# EAGLE design master_jorge (EAGLE 7.1.0)
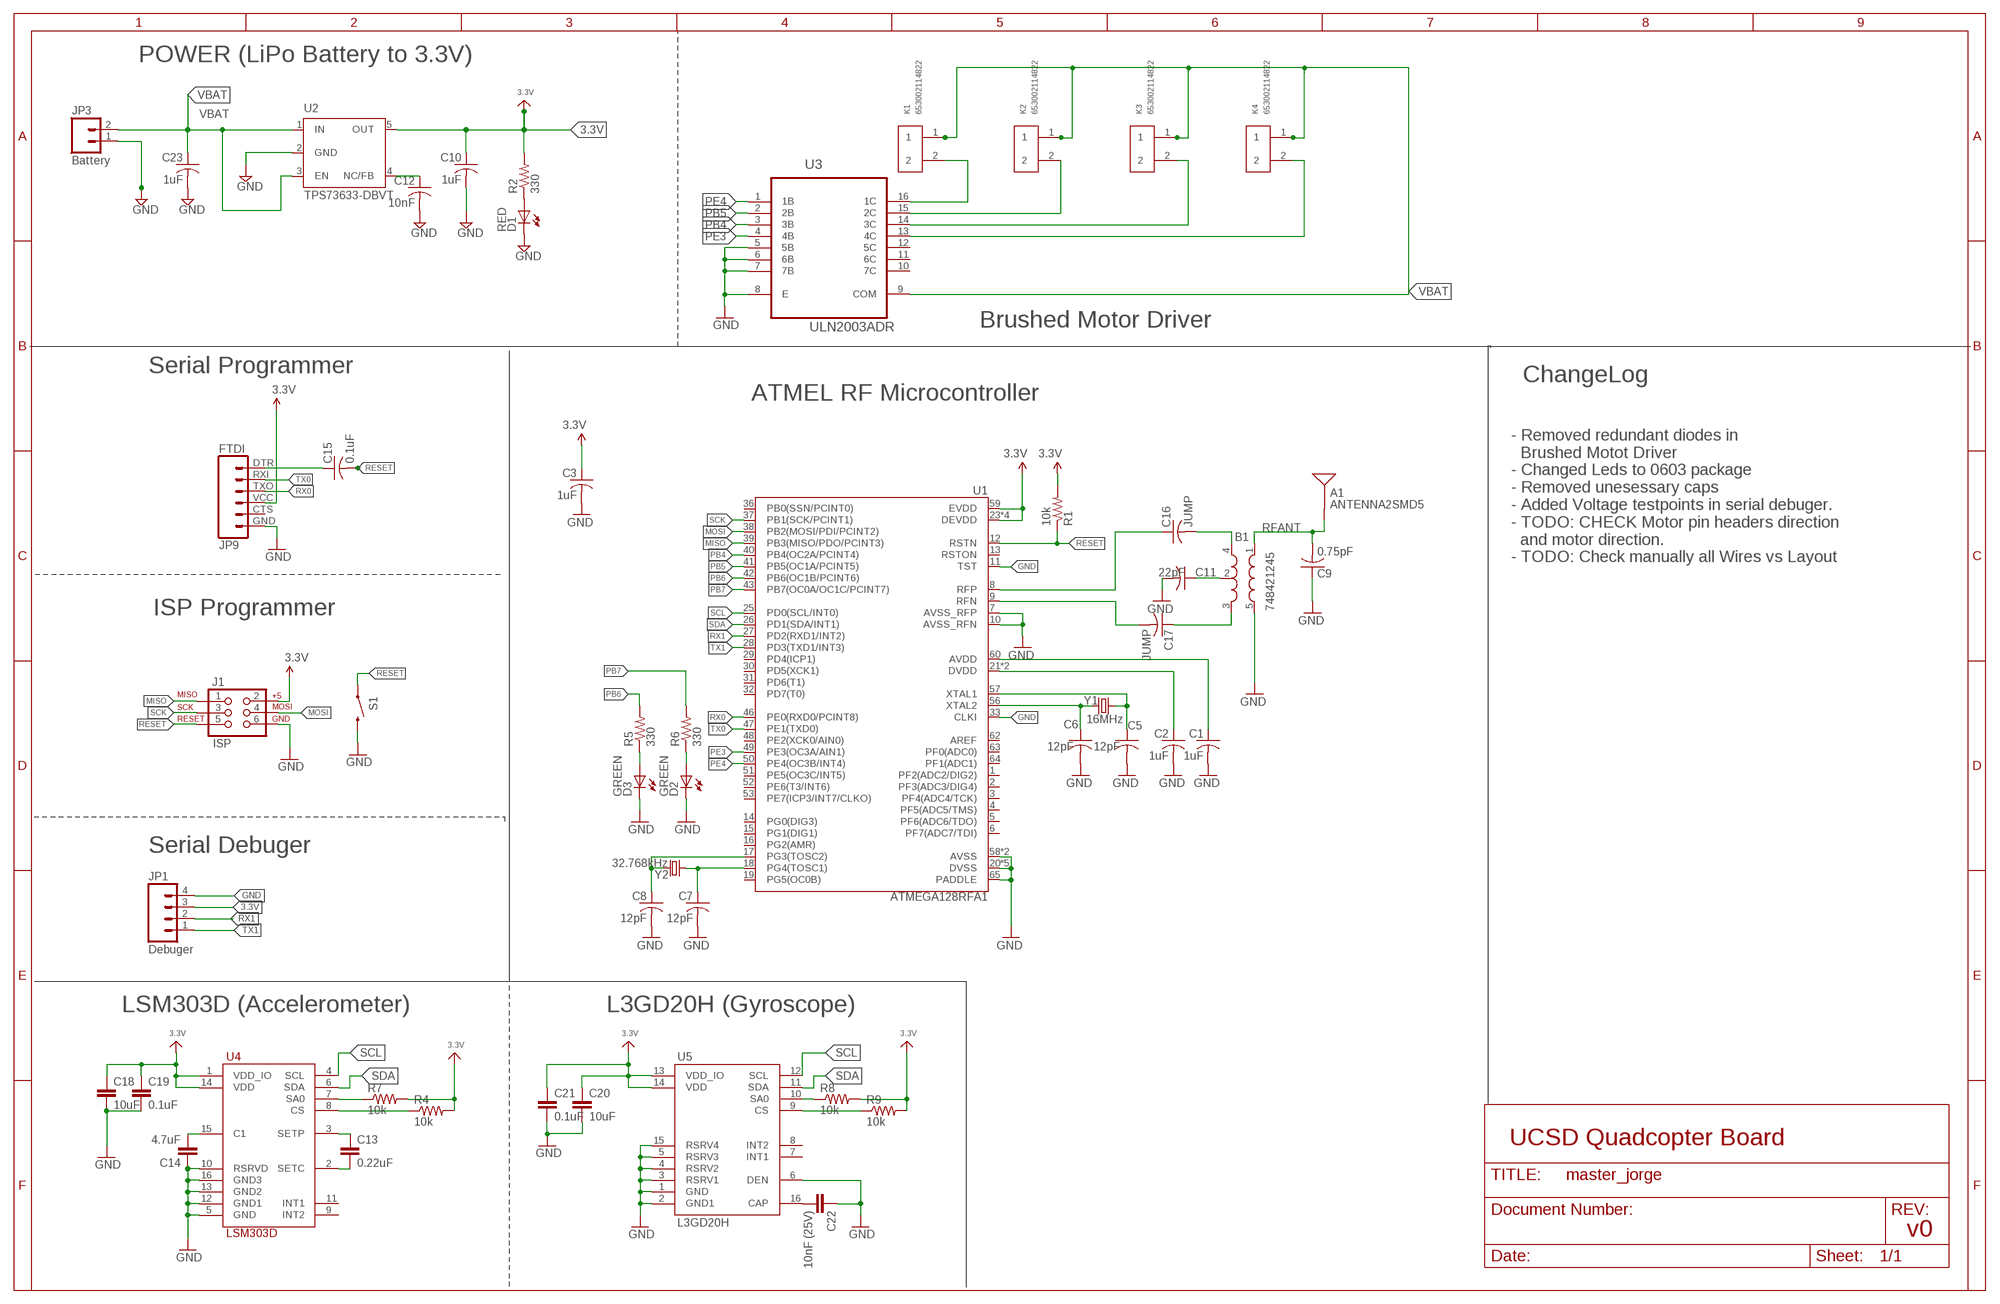
[diagram p0: schematic, sheet 1]

## Parts
A1  ANTENNA2SMD5  [ANTENNA-CHIP5]
B1  748421245  BALUN0805  [BALUN]
C1  1uF  C-USC0805  [C0805]
C2  1uF  C-USC0805  [C0805]
C3  1uF  C-USC0805  [C0805]
C5  12pF  C-USC0805  [C0805]
C6  12pF  C-USC0805  [C0805]
C7  12pF  C-USC0805  [C0805]
C8  12pF  C-USC0805  [C0805]
C9  0.75pF  C-USC0805  [C0805]
C10  1uF  C-USC0805  [C0805]
C11  22pF  C-USC0805  [C0805]
C12  10nF  C-USC0805  [C0805]
C13  0.22uF  CAP0805  [0805]
C14  4.7uF  CAP0805  [0805]
C15  0.1uF  C-USC0805  [C0805]
C16  JUMP  C-USC0805  [C0805]
C17  JUMP  C-USC0805  [C0805]
C18  10uF  CAP0805  [0805]
C19  0.1uF  CAP0805  [0805]
C20  10uF  CAP0805  [0805]
C21  0.1uF  CAP0805  [0805]
C22  10nF (25V)  CAP0805  [0805]
C23  1uF  C-USC0805  [C0805]
D1  RED  LEDCHIPLED_0603  [CHIPLED_0603]
D2  GREEN  LEDCHIPLED_0603  [CHIPLED_0603]
D3  GREEN  LEDCHIPLED_0603  [CHIPLED_0603]
J1  ISP  AVR_SPI_PRG_6NS  [2X3-NS]
JP1  Debuger  M04PTH  [1X04]
JP3  Battery  M02PTH  [1X02]
JP9  FTDI  FTDI_BASICPTH  [FTDI_BASIC]
K1  653002114822  [653002114822]
K2  653002114822  [653002114822]
K3  653002114822  [653002114822]
K4  653002114822  [653002114822]
R1  10k  R-US_R0805  [R0805]
R2  330  R-US_R0805  [R0805]
R4  10k  RESISTOR0805-RES  [0805]
R5  330  R-US_R0805  [R0805]
R6  330  R-US_R0805  [R0805]
R7  10k  RESISTOR0805-RES  [0805]
R8  10k  RESISTOR0805-RES  [0805]
R9  10k  RESISTOR0805-RES  [0805]
S1  SWITCH-MOMENTARY-2SMD  [TACTILE_SWITCH_SMD]
U1  ATMEGA128RFA1  [QFN-64]
U2  TPS73633-DBVT  [SOT23-DBV]
U3  ULN2003ADR  [SOIC127P600X175-16N]
U4  LSM303D  [LGA16_3X3MM]
U5  L3GD20H  [LGA16_3X3MM]
Y1  16MHz  CRYSTAL5X3  [CRYSTAL-SMD-5X3]
Y2  32.768kHz  CRYSTAL32-SMD  [CRYSTAL-32KHZ-SMD]

## Nets
3.3V: C3.1 C10.1 C18.1 C19.1 C20.1 C21.1 J1.2 JP1.3 JP9.VCC R1.2 R2.2 R4.2 R7.2 R8.2 R9.2 U1.23(DEVDD) U1.34(DEVDD) U1.44(DEVDD) U1.54(DEVDD) U1.59(EVDD) U2.5(OUT) U4.1(VDD_IO) U4.14(VDD) U5.13(VDD_IO) U5.14(VDD)
AVDD: C1.1 U1.60(AVDD)
DTR: C15.1 JP9.DTR
DVDD: C2.1 U1.21(DVDD) U1.22(DVDD)
GND: B1.5(GND) C1.2 C2.2 C3.2 C5.2 C6.2 C7.2 C8.2 C9.1 C10.2 C11.2 C12.2 C14.1 C18.2 C19.2 C20.2 C21.2 C22.1 C23.2 D1.C D2.C D3.C J1.6 JP1.4 JP3.1 JP9.GND S1.3 U1.7(AVSS_RFP) U1.10(AVSS_RFN) U1.11(TST) U1.20(DVSS) U1.24(DVSS) U1.33(CLKI) U1.35(DVSS) U1.45(DVSS) U1.55(DVSS) U1.58(AVSS) U1.61(AVSS) U1.65(PADDLE) U2.2(GND) U3.5(5B) U3.6(6B) U3.7(7B) U3.8(E) U4.5(GND) U4.10(RSRVD) U4.12(GND1) U4.13(GND2) U4.16(GND3) U5.1(GND) U5.2(GND1) U5.3(RSRV1) U5.4(RSRV2) U5.5(RSRV3) U5.6(DEN) U5.15(RSRV4)
MISO: J1.1 U1.39(PB3(MISO/PDO/PCINT3))
MOSI: J1.4 U1.38(PB2(MOSI/PDI/PCINT2))
N$1: C12.1 U2.4(NC/FB)
N$2: D1.A R2.1
N$3: C5.1 U1.57(XTAL1) Y1.3
N$4: C6.1 U1.56(XTAL2) Y1.1
N$5: C7.1 U1.18(PG4(TOSC1)) Y2.X1
N$6: C8.1 U1.17(PG3(TOSC2)) Y2.X2
N$7: B1.2(GND) C11.1
N$8: D3.A R5.1
N$9: C13.1 U4.3(SETP)
N$10: B1.4(OUT1) C16.2
N$11: B1.3(OUT2) C17.1
N$12: C13.2 U4.2(SETC)
N$13: D2.A R6.1
N$14: R4.1 U4.8(CS)
N$15: R7.1 U4.7(SA0)
N$16: C14.2 U4.15(C1)
N$17: R8.1 U5.10(SA0)
N$18: R9.1 U5.9(CS)
N$19: C22.2 U5.16(CAP)
N$29: K1.2 U3.16(1C)
N$30: K2.2 U3.15(2C)
N$31: K3.2 U3.14(3C)
N$32: K4.2 U3.13(4C)
PB4: U1.40(PB4(OC2A/PCINT4)) U3.3(3B)
PB5: U1.41(PB5(OC1A/PCINT5)) U3.2(2B)
PB6: R5.2 U1.42(PB6(OC1B/PCINT6))
PB7: R6.2 U1.43(PB7(OC0A/OC1C/PCINT7))
PE3: U1.49(PE3(OC3A/AIN1)) U3.4(4B)
PE4: U1.50(PE4(OC3B/INT4)) U3.1(1B)
RESET: C15.2 J1.5 R1.1 S1.1 U1.12(RSTN)
RFANT [RFSIG]: A1.FEED(SIGNAL) B1.1(IN) C9.2
RFN: C17.2 U1.9(RFN)
RFP: C16.1 U1.8(RFP)
RX0: JP9.TXO U1.46(PE0(RXD0/PCINT8))
RX1: JP1.2 U1.27(PD2(RXD1/INT2))
SCK: J1.3 U1.37(PB1(SCK/PCINT1))
SCL: U1.25(PD0(SCL/INT0)) U4.4(SCL) U5.12(SCL)
SDA: U1.26(PD1(SDA/INT1)) U4.6(SDA) U5.11(SDA)
TX0: JP9.RXI U1.47(PE1(TXD0))
TX1: JP1.1 U1.28(PD3(TXD1/INT3))
VBAT: C23.1 JP3.2 K1.1 K2.1 K3.1 K4.1 U2.1(IN) U2.3(EN) U3.9(COM)
Unconnected: JP9.CTS U1.1(PF2(ADC2/DIG2)) U1.2(PF3(ADC3/DIG4)) U1.3(PF4(ADC4/TCK)) U1.4(PF5(ADC5/TMS)) U1.5(PF6(ADC6/TDO)) U1.6(PF7(ADC7/TDI)) U1.13(RSTON) U1.14(PG0(DIG3)) U1.15(PG1(DIG1)) U1.16(PG2(AMR)) U1.19(PG5(OC0B)) U1.29(PD4(ICP1)) U1.30(PD5(XCK1)) U1.31(PD6(T1)) U1.32(PD7(T0)) U1.36(PB0(SSN/PCINT0)) U1.48(PE2(XCK0/AIN0)) U1.51(PE5(OC3C/INT5)) U1.52(PE6(T3/INT6)) U1.53(PE7(ICP3/INT7/CLKO)) U1.62(AREF) U1.63(PF0(ADC0)) U1.64(PF1(ADC1)) U3.10(7C) U3.11(6C) U3.12(5C) U4.9(INT2) U4.11(INT1) U5.7(INT1) U5.8(INT2)

## Notes on the sheet
- POWER (LiPo Battery to 3.3V)
- Brushed Motor Driver
- Serial Programmer
- ChangeLog
- ATMEL RF Microcontroller
- - Removed redundant diodes in 
    Brushed Motot Driver
  - Changed Leds to 0603 package
  - Removed unesessary caps
  - Added Voltage testpoints in serial debuger.
  - TODO: CHECK Motor pin headers direction
    and motor direction.
  - TODO: Check manually all Wires vs Layout
- ISP Programmer
- Serial Debuger
- LSM303D (Accelerometer) | L3GD20H (Gyroscope)
- UCSD Quadcopter Board
- v0

## Library data of the parts
A1 = SparkFun-RF:ANTENNA2: Chip antenna Single endded antenna. Common with smaller chip antennas. CHIP4 package is the GPS Chip Antenna SKU: GPS-08418. CHIP5 package is 2.4GHz chip antenna SKU: WRL-00144.
B1 = SparkFun-RF:BALUN: 0805 footprint balun- Ember 351/357
C1-C3 C5-C12 C15-C17 C23 = resistor:C-US: CAPACITOR, American symbol
C13 C14 C18-C22 = SparkFun-Capacitors:CAP: Capacitor Standard 0603 ceramic capacitor, and 0.1" leaded capacitor.
D1-D3 = led:LED: LED OSRAM: - CHIPLED LG R971, LG N971, LY N971, LG Q971, LY Q971, LO R971, LY R971 LH N974, LH R974 LS Q976, LO Q976, LY Q976 LO Q996 - Hyper CHIPLED LW Q18S LB Q993, LB Q99A, LB R99A - SideLED LS A670, LO A670, LY A670, LG A670, LP A670 LB A673, LV A673, LT A673, LW A673 LH A674 LY A675 LS A676, LA A676, LO A676, LY A676, LW A676 LS A679, LY A679, LG A679 - Hyper Micro SIDELED® LS Y876, LA Y876, LO Y876, LY Y876 LT Y87S - SmartLED LW L88C, LW L88S LB L89C, LB L89S, LG L890 LS L89K, LO L89K, LY L89K LS L896, LA L896, LO L896, LY L896 - TOPLED LS T670, LO T670, LY T670, LG T670, LP T670 LSG T670, LSP T670, LSY T670, LOP T670, LYG T670 LG T671, LOG T671, LSG T671 LB T673, LV T673, LT T673, LW T673 LH T674 LS T676, LA T676, LO T676, LY T676, LB T676, LH T676, LSB T676, LW T676 LB T67C, LV T67C, LT T67C, LS T67K, LO T67K, LY T67K, LW E67C LS E67B, LA E67B, LO E67B, LY E67B, LB E67C, LV E67C, LT E67C LW T67C LS T679, LY T679, LG T679 LS T770, LO T770, LY T770, LG T770, LP T770 LB T773, LV T773, LT T773, LW T773 LH T774 LS E675, LA E675, LY E675, LS T675 LS T776, LA T776, LO T776, LY T776, LB T776 LHGB T686 LT T68C, LB T68C - Hyper Mini TOPLED® LB M676 - Mini TOPLED Santana® LG M470 LS M47K, LO M47K, LY M47K Source: http://www.osram.convergy.de LUXEON: - LUMILED® LXK2-PW12-R00, LXK2-PW12-S00, LXK2-PW14-U00, LXK2-PW14-V00 LXK2-PM12-R00, LXK2-PM12-S00, LXK2-PM14-U00 LXK2-PE12-Q00, LXK2-PE12-R00, LXK2-PE12-S00, LXK2-PE14-T00, LXK2-PE14-U00 LXK2-PB12-K00, LXK2-PB12-L00, LXK2-PB12-M00, LXK2-PB14-N00, LXK2-PB14-P00, LXK2-PB14-Q00 LXK2-PR12-L00, LXK2-PR12-M00, LXK2-PR14-Q00, LXK2-PR14-R00 LXK2-PD12-Q00, LXK2-PD12-R00, LXK2-PD12-S00 LXK2-PH12-R00, LXK2-PH12-S00 LXK2-PL12-P00, LXK2-PL12-Q00, LXK2-PL12-R00 Source: www.luxeon.com KINGBRIGHT: KA-3528ASYC Source: www.kingbright.com
J1 = SparkFun-Connectors:AVR_SPI_PRG_6: AVR ISP 6 Pin This is the reduced ISP connector for AVR programming. Common on Arduino. This footprint will take up less PCB space and can be used with a 10-pin to 6-pin adapter such as SKU: BOB-08508
JP1 = SparkFun-Connectors:M04: Header 4 Standard 4-pin 0.1" header. Use with straight break away headers (SKU : PRT-00116), right angle break away headers (PRT-00553), swiss pins (PRT-00743), machine pins (PRT-00117), and female headers (PRT-00115). Molex polarized connector foot print use with SKU : PRT-08231 with associated crimp pins and housings. 1MM SMD Version SKU: PRT-10208
JP3 = SparkFun:M02: Header 2 Standard 2-pin 0.1" header. Use with straight break away headers (SKU : PRT-00116), right angle break away headers (PRT-00553), swiss pins (PRT-00743), machine pins (PRT-00117), and female headers (PRT-00115). Molex polarized connector foot print use with SKU : PRT-08233 with associated crimp pins and housings.
JP9 = SparkFun-Connectors:FTDI_BASIC: FTDI Basic header with labels
K1-K4 = Wuerth_Elektronik_eiCan_Wire_to_Board_Connectors:653002114822: WR-WTB 1.25mm Male Vertical Shrouded Header, 2 Pins=>Code : Con_WTB_1.25_PCB_THT_653002114822 <http://katalog.we-online.de/media/thumbs2/eican/thb_Con_WTB_1.25_PCB_THT_6530xx114822_pf2.jpg> Details see: http://katalog.we-online.de/en/em/653_0xx_114_822 Created 2014-06-06, Karrer Zheng 2014 (C) Würth Elektronik; OC_FARNELL: unknown
R1 R2 R5 R6 = resistor:R-US_: RESISTOR, American symbol
R4 R7-R9 = SparkFun-Passives:RESISTOR: Resistor Basic schematic elements and footprints for 0603, 1206, and PTH resistors.
S1 = SparkFun-Electromechanical:SWITCH-MOMENTARY-2: Various NO switches- pushbuttons, reed, etc
U1 = SparkFun-DigitalIC:ATMEGA128RFA1: ATmega128RFA1 8-bit AVR Microcontroller with Low Power 2.4GHz Transceiver for ZigBee and IEEE 802.15.4
U2 = Power:TPS73633-DBVT
U3 = Texas Instruments_By_element14_Batch_1:ULN2003ADR: 8-BIT SHIFT REGISTERS WITH 3-STATE OUTPUT REGISTERS; MPN: ULN2003ADR; OC_FARNELL: 1470513; OC_NEWARK: 77C3560; PACKAGE: SOIC-16; SUPPLIER: TEXAS INSTRUMENTS
U4 = IMU_parts:LSM303D
U5 = IMU_parts:L3GD20H
Y1 Y2 = SparkFun-FreqCtrl:CRYSTAL: Various standard crystals. Proven footprints. Spark Fun Electronics SKU : COM-00534

## Net classes
1 RFSIG: width 0.457 mm, clearance 0.205 mm to class 0, clearance 0.205 mm

## Board
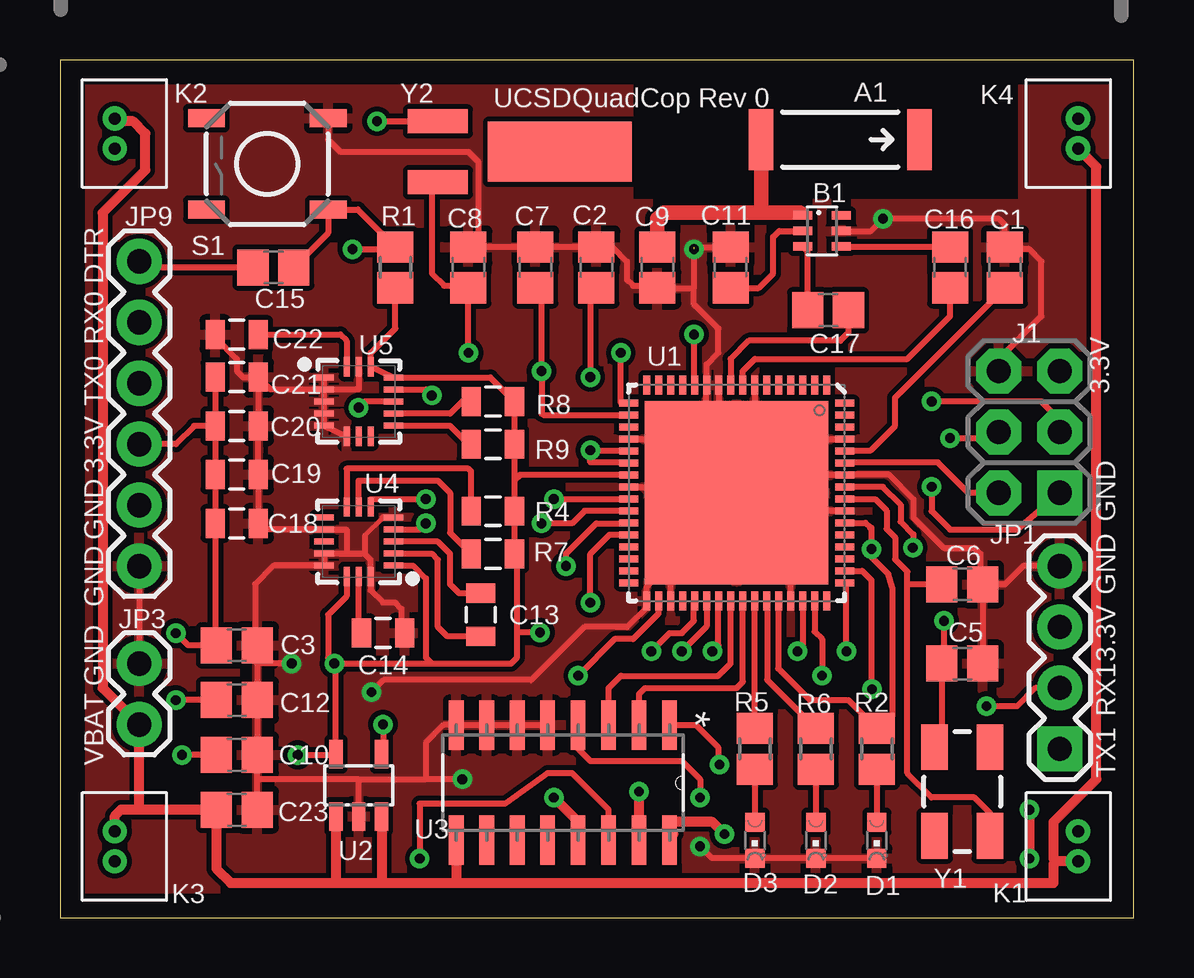
[diagram p1: board, top side]
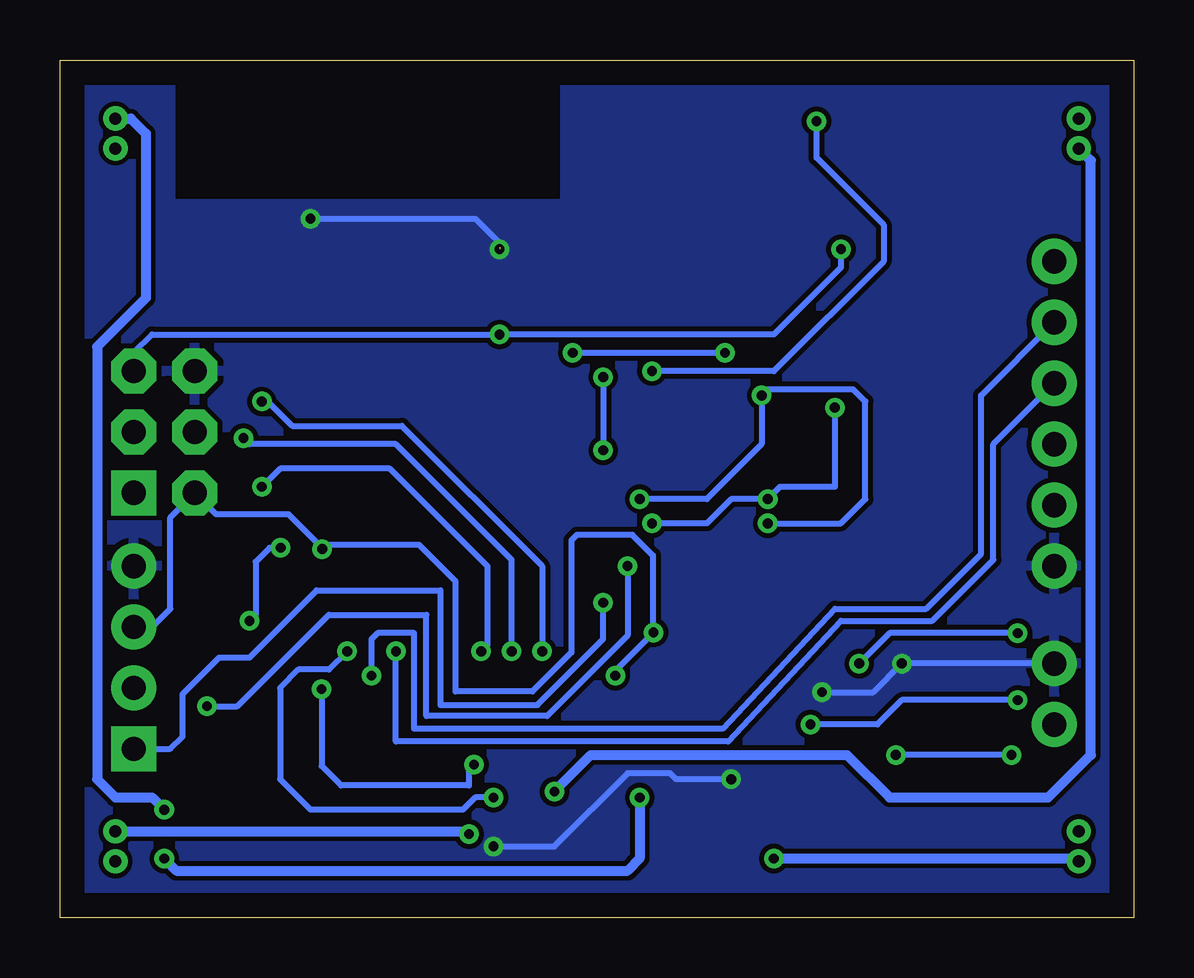
[diagram p2: board, bottom side, seen from below]

Size 44.73 x 35.75 mm. Coordinates in mm from the lower left corner, seen from the top.
Outline: 0,0 44.73,0 44.73,35.75 0,35.75 0,0
Copper layers (1*16): Top 0.035mm / dielectric 1.5mm / Bottom 0.035mm
Design rules "default *": minimum track width 1mil, minimum drill 0.003mm, track to track 8mil, track to pad 8mil, pad to pad 8mil, via to via 8mil, smd to smd 8mil, copper to edge 40mil, drill to drill 8mil, minimum pad ring 10mil, minimum via ring 8mil, stop-mask expansion 4mil, vias tented up to drill 0mil, thermal gap 10mil
tRestrict: area 35.1,34 to 36.6,35.3; area 35.1,30 to 36.6,31; area 28.5,34 to 30,35.3; area 23.9,30 to 28.5,35.3; area 30,30 to 35.1,35.3; area 36.6,30 to 39.9,35.3
bRestrict: area 30,30 to 35.1,35.3; area 36.6,30 to 39.9,35.3; area 23.9,30 to 28.5,35.3; area 28.5,34 to 30,35.3; area 35.1,34 to 36.6,35.3; area 35.1,30 to 36.6,31; area 28.5,30 to 30,34

### Footprints (pad centres in the part's own frame; a part is rotated, then mirrored left to right if it is on the bottom)
ANTENNA-CHIP5 = smd 1.016 x 2.54: FEED -3.302,0; NC 3.302,0
BALUN = smd 0.35 x 0.8: 1 -0.65,-0.8; 2 0,-0.8; 3 0.65,-0.8; 4 0.65,0.8; 5 0,0.8; 6 -0.65,0.8
C0805 = smd 1.3 x 1.5: 1 -0.85,0; 2 0.85,0
0805 = smd 0.8 x 1.2: 1 -0.9,0; 2 0.9,0
CHIPLED_0603 = smd 0.8 x 0.8: A 0,-0.75; C 0,0.75
2X3-NS = drill 1.016 pad 1.88 square: 1 -2.54,-1.27 | drill 1.016 pad 1.88 octagon: 2 -2.54,1.27; 3 0,-1.27; 4 0,1.27; 5 2.54,-1.27; 6 2.54,1.27
1X04 = drill 1.016 pad 1.88 square: 1 0,0 | drill 1.016 pad 1.88: 2 2.54,0; 3 5.08,0; 4 7.62,0
1X02 = drill 1.016 pad 1.88: 1 0,0; 2 2.54,0
FTDI_BASIC = drill 1.016 pad 1.88: CTS 10.16,0; DTR 0,0; GND 12.7,0; RXI 2.54,0; TXO 5.08,0; VCC 7.62,0
653002114822 = drill 0.5: 1 0.625,0; 2 -0.625,0
R0805 = smd 1.3 x 1.5: 1 -0.85,0; 2 0.85,0
TACTILE_SWITCH_SMD = smd 1.524 x 0.762: 1 -2.54,1.905; 2 2.54,1.905; 3 -2.54,-1.905; 4 2.54,-1.905
QFN-64 = smd 0.8 x 0.28: 1 -4.5,3.75; 2 -4.5,3.25; 3 -4.5,2.75; 4 -4.5,2.25; 5 -4.5,1.75; 6 -4.5,1.25; 7 -4.5,0.75; 8 -4.5,0.25; 9 -4.5,-0.25; 10 -4.5,-0.75; 11 -4.5,-1.25; 12 -4.5,-1.75; 13 -4.5,-2.25; 14 -4.5,-2.75; 15 -4.5,-3.25; 16 -4.5,-3.75; 33 4.5,-3.75; 34 4.5,-3.25; 35 4.5,-2.75; 36 4.5,-2.25; 37 4.5,-1.75; 38 4.5,-1.25; 39 4.5,-0.75; 40 4.5,-0.25; 41 4.5,0.25; 42 4.5,0.75; 43 4.5,1.25; 44 4.5,1.75; 45 4.5,2.25; 46 4.5,2.75; 47 4.5,3.25; 48 4.5,3.75 | smd 0.28 x 0.8: 17 -3.75,-4.5; 18 -3.25,-4.5; 19 -2.75,-4.5; 20 -2.25,-4.5; 21 -1.75,-4.5; 22 -1.25,-4.5; 23 -0.75,-4.5; 24 -0.25,-4.5; 25 0.25,-4.5; 26 0.75,-4.5; 27 1.25,-4.5; 28 1.75,-4.5; 29 2.25,-4.5; 30 2.75,-4.5; 31 3.25,-4.5; 32 3.75,-4.5; 49 3.75,4.5; 50 3.25,4.5; 51 2.75,4.5; 52 2.25,4.5; 53 1.75,4.5; 54 1.25,4.5; 55 0.75,4.5; 56 0.25,4.5; 57 -0.25,4.5; 58 -0.75,4.5; 59 -1.25,4.5; 60 -1.75,4.5; 61 -2.25,4.5; 62 -2.75,4.5; 63 -3.25,4.5; 64 -3.75,4.5 | smd 7.65 x 7.65: 65 0,0
SOT23-DBV = smd 0.55 x 1.2: 1 -0.95,-1.3; 2 0,-1.3; 3 0.95,-1.3; 4 0.95,1.3; 5 -0.95,1.3
SOIC127P600X175-16N = smd 2.057 x 0.61: 1 -4.801,8.89; 2 -4.801,7.62; 3 -4.801,6.35; 4 -4.801,5.08; 5 -4.801,3.81; 6 -4.801,2.54; 7 -4.801,1.27; 8 -4.801,0; 9 0,0; 10 0,1.27; 11 0,2.54; 12 0,3.81; 13 0,5.08; 14 0,6.35; 15 0,7.62; 16 0,8.89
LGA16_3X3MM = smd 0.8 x 0.25: 1 -1.45,1; 2 -1.45,0.5; 3 -1.45,0; 4 -1.45,-0.5; 5 -1.45,-1; 9 1.45,-1; 10 1.45,-0.5; 11 1.45,0; 12 1.45,0.5; 13 1.45,1 | smd 0.25 x 0.8: 6 -0.5,-1.45; 7 0,-1.45; 8 0.5,-1.45; 14 0.5,1.45; 15 0,1.45; 16 -0.5,1.45
CRYSTAL-SMD-5X3 = smd 1.9 x 1.1: 1 -1.85,-1.15; 2 1.85,-1.15; 3 1.85,1.15; 4 -1.85,1.15
CRYSTAL-32KHZ-SMD = smd 2.5 x 6: SHEILD 0,5.08 | smd 1 x 2.5: X1 -1.27,0; X2 1.27,0

### Placement (x,y rotation side)
A1  32.51,32.44 0 top
B1  31.75,28.63 270 top
C1  39.37,27.1 90 top
C2  22.35,27.1 90 top
C3  7.37,11.35 0 top
C5  37.59,10.59 0 top
C6  37.59,13.89 0 top
C7  19.81,27.1 90 top
C8  17.02,27.1 90 top
C9  24.89,27.1 90 top
C10  7.37,6.78 0 top
C11  27.94,27.1 90 top
C12  7.37,9.07 0 top
C13  17.53,12.62 270 top
C14  13.46,11.86 180 top
C15  8.89,27.1 0 top
C16  37.08,27.1 90 top
C17  32,25.32 0 top
C18  7.37,16.43 0 top
C19  7.37,18.47 0 top
C20  7.37,20.5 0 top
C21  7.37,22.53 0 top
C22  7.37,24.31 0 top
C23  7.37,4.5 0 top
D1  34.04,3.23 180 top
D2  31.5,3.23 180 top
D3  28.96,3.23 180 top
J1  40.39,20.24 90 top
JP1  41.66,7.04 90 top
JP3  3.3,10.59 270 top
JP9  3.3,27.36 270 top
K1  42.42,2.97 270 top
K2  2.29,32.69 90 top
K3  2.29,2.97 90 top
K4  42.42,32.69 270 top
R1  13.97,27.1 270 top
R2  34.04,7.04 90 top
R4  18.03,16.94 0 top
R5  28.96,7.04 90 top
R6  31.5,7.04 90 top
R7  18.03,15.16 0 top
R8  18.03,21.51 0 top
R9  18.03,19.74 0 top
S1  8.64,31.42 180 top
U1  28.19,17.7 270 top
U2  12.45,5.51 0 top
U3  16.51,3.23 270 top
U4  12.45,15.67 180 top
U5  12.45,21.51 0 top
Y1  37.59,5.26 90 top
Y2  15.75,31.93 270 top

### Tracks (layer width: path | path; a pad name or v marks a point on that pad's centre or on a via)
3.3V  (via drill 0.41)
  Top 0.254: 18.93,18.21 R9.2 R8.2 17.93,22.51 U5.13 U5.14 12.95,23.54 13.97,24.56 R1.2 | 18.93,18.21 R4.2 R7.2 19.05,15.05 19.05,11.9 | J1.2 37.85,17.7 36.58,18.97 32.71,18.97 U1.59 | 19.05,11.9 19.05,10.85 18.8,10.59 15.49,10.59 | U1.23 19.18,18.45 18.93,18.21 | C21.1 C20.1 | C20.1 C19.1 C18.1 6.47,11.4 C3.1 5.33,11.35 v4.83,11.86 | U4.14 11.95,13.39 11.18,12.62 11.18,10.85 v11.43,10.59 | v11.43,10.59 15.49,10.59 | U4.1 14.72,14.67 15.24,14.15 15.24,10.85 15.49,10.59 | C20.1 5.59,20.5 4.83,19.74 JP9.VCC | v11.43,10.59 11.5,10.53 U2.5 11.47,6.78 v9.91,6.78 | C10.1 v5.08,6.78 | U1.54 33.56,16.45 33.76,16.26 33.81,16.26 v33.81,15.37 33.81,15.04 34.52,14.33 34.67,13.77 34.67,8.39 R2.2 32.85,9.07 31.24,9.07 29.92,10.39 29.92,13.18 | U1.34 24.94,12.68 23.88,11.61 23.11,11.61 v21.59,10.08 | 29.92,13.2 U1.44 29.92,13.18 | 29.92,13.31 29.92,13.18 | v20,11.88 19.07,11.88 19.05,11.9
  Bottom 0.254: v4.83,11.86 10.16,11.86 v11.43,10.59 | v5.08,6.78 v9.91,6.78 | JP1.3 40.89,12.12 40.13,12.88 40.13,16.69 J1.2 38.23,16.82 35.2,16.82 33.81,15.42 v33.81,15.37 33.63,15.54 29.77,15.54 28.24,14.02 28.24,9.42 25.04,9.42 23.42,11.05 23.42,15.72 23.19,15.95 20.88,15.95 20.03,15.1 20.03,11.91 v20,11.88 21.59,10.29 v21.59,10.08
AVDD
  Top 0.254: U1.60 32.72,19.48 33.78,19.48 34.8,20.5 34.8,21.68 C1.1
DTR
  Top 0.254: C15.1 3.56,27.1 JP9.DTR
DVDD  (via drill 0.41)
  Top 0.254: C2.1 22.1,26.25 v22.1,22.53 | U1.22 23.69,18.97 22.1,18.97 v22.1,19.48 23.69,19.48 U1.21
  Bottom 0.254: v22.1,22.53 v22.1,19.48
GND  (via drill 0.41)  (1 unrouted)
  Top 0.178: 12.7,15.93 13.46,16.69
  Top 0.241: 13.46,16.69 13.88,16.69 U4.5
  Top 0.254: C23.2 8.22,5.77 | 8.22,5.77 C10.2 C12.2 8.22,10.59 | 8.22,10.59 C3.2 8.13,11.44 8.13,13.89 8.91,14.67 U4.13 U4.12 | 12.45,5.77 8.22,5.77 | C6.2 C5.2 | U3.5 U3.6 U3.7 U3.8 15.98,8.03 15.24,7.29 15.24,5.77 | 17.55,27.95 C7.2 C2.2 23.03,27.95 23.62,27.36 23.62,26.59 23.88,26.34 24.8,26.34 C9.1 26.42,26.25 | 17.55,27.95 C8.2 | 11.18,33.45 S1.3 11.18,32.44 11.68,31.93 17.02,31.93 17.42,31.52 17.42,28.08 17.55,27.95 | U5.2 10.99,22.02 8.77,22.02 C21.2 | 12.7,15.16 12.95,14.92 U4.16 12.95,13.65 13.46,13.13 13.97,13.13 14.22,12.88 14.22,12 C14.1 | 12.7,15.16 11.94,15.16 | 11.94,15.16 U4.12 | U4.12 | U4.5 13.45,16.67 | 12.7,15.93 12.7,15.16 | U5.1 U5.2 | U5.2 U5.3 U5.4 U5.5 U5.6 | 11.94,15.16 11.94,16.18 11.93,16.17 U4.10 8.53,16.17 C18.2 C19.2 C20.2 C21.2 | JP9.GND JP3.1 | U5.15 12.45,22.02 11,22.02 U5.2 | C22.1 6.47,24.19 7.37,23.29 7.37,22.78 7.62,22.53 C21.2 | v9.65,10.59 8.22,10.59 | JP1.4 40.13,14.66 39.37,13.89 C6.2 | U1.10 27.44,18.45 | 27.44,18.45 U1.65 | 27.44,18.45 26.94,17.95 25.6,17.95 | U1.7 28.94,19.95 | 28.94,19.95 27.44,18.45 | 28.94,19.95 U1.61 | U1.10 27.44,20.76 26.92,20.24 26.92,22.18 U1.11 26.94,23.06 27.43,23.55 27.43,24.56 26.42,25.58 26.42,26.25 | U1.10 27.44,20.23 27.94,19.74 25.65,19.74 25.4,19.99 25.36,19.95 U1.20 | U1.10 27.44,21.25 30.23,18.47 | 30.23,18.47 32.69,18.47 | U1.10 27.44,17.72 | 26.42,26.25 26.42,27.95 C11.2 | B1.5 33.78,28.63 v34.29,29.13 39.12,29.13 39.37,28.88 C1.2 39.46,27.86 40.39,27.86 40.89,27.36 40.89,25.07 39.12,23.29 J1.6 | 32.71,18.47 U1.58 32.69,18.47 | 34.04,2.46 D1.C D2.C D3.C 27.17,2.48 v26.67,2.97 | v16.76,5.77 15.24,5.77 | C6.2 38.35,13.98 38.35,15.16 38.1,15.42 36.83,15.42 35.56,16.69 35.56,17.45 34.54,18.47 32.69,18.47
  Top 0.254: U2.2 12.45,5.77 | 12.45,5.77 15.24,5.77 | U1.24 25.6,17.95 | 25.45,14.93 24.44,13.78 U1.33 24.44,12.94 23.62,12.12 21.84,12.12 20.32,10.59 19.63,9.9 13.48,9.9 v12.98,9.4 | 25.45,14.93 25.65,15.16 25.65,17.9 25.6,17.95 | U1.45 30.44,16.95 | 30.44,16.95 30.44,18.25 30.23,18.47 | U1.55 30.44,16.95 | U1.35 25.45,14.93
  Bottom 0.254: JP3.1 v9.65,10.59 10.85,9.4 v12.98,9.4 | v26.42,27.86 26.42,28.12 27.43,29.13 v34.29,29.13 | v16.76,5.77 19.05,5.77 19.3,6.02 21.08,6.02 24.13,2.97 v26.67,2.97
  pour Bottom: 0.28,35.56 0.28,0 44.48,0 44.48,35.81 0.28,35.81
  pour Top: 0.28,35.56 0.28,0 44.48,0 44.48,35.81 0.28,35.81
MISO  (via drill 0.41)
  Top 0.254: v27.18,11.1 27.43,11.35 27.43,13.19 U1.39 | J1.1 39.88,16.18 37.08,16.18 36.32,16.94 v36.32,17.96
  Bottom 0.254: v27.18,11.1 26.92,11.35 26.92,14.66 30.99,18.72 35.56,18.72 v36.32,17.96
MOSI  (via drill 0.41)
  Top 0.254: U1.38 26.94,12.14 v25.91,11.1 | v37.08,19.99 38.86,19.99 J1.4
  Bottom 0.254: v25.91,11.1 25.91,14.91 30.73,19.74 36.83,19.74 v37.08,19.99
N$1  (via drill 0.41)
  Top 0.254: C12.1 v4.83,9.07 | v13.46,8.05 13.46,6.88 U2.4
  Bottom 0.254: v4.83,9.07 9.65,9.07 10.67,8.05 v13.46,8.05
N$2
  Top 0.254: R2.1 D1.A
N$3  (via drill 0.41)
  Top 0.254: Y1.3 36.74,7.41 C5.1 36.83,10.68 v36.83,12.37 | U1.57 34.29,17.96 35.03,17.22 35.03,16.51 35.56,15.98 35.56,15.44 v35.53,15.42
  Bottom 0.254: v36.83,12.37 36.58,12.62 36.58,14.83 35.99,15.42 v35.53,15.42
N$4
  Top 0.254: Y1.1 38.74,4.36 38.1,5 36.32,5 35.31,6.02 35.31,13.89 | 35.31,13.89 35.31,14.43 34.8,14.94 34.8,15.85 34.44,16.2 34.44,16.97 33.96,17.45 U1.56 | C6.1 35.31,13.89
N$5  (via drill 0.41)
  Top 0.254: Y2.X1 16,33.2 | Y2.X1 14.99,33.2 | C7.1 20.07,26 v20.07,22.78 20.07,21.01 20.09,21.01 20.14,20.95 U1.18 | v13.21,33.2 Y2.X1
  Bottom 0.254: v20.07,22.78 14.99,22.78 10.41,27.36 10.41,28.88 13.21,31.67 v13.21,33.2
N$6  (via drill 0.41)
  Top 0.254: Y2.X2 15.49,30.66 15.49,26.85 16,26.34 16.93,26.34 C8.1 v17.02,23.55 | U1.17 23.37,21.45 v23.37,23.55
  Bottom 0.254: v23.37,23.55 v17.02,23.55
N$7
  Top 0.254: C11.1 29.12,26.25 29.72,26.85 29.72,28.37 29.97,28.63 B1.2
N$8
  Top 0.254: R5.1 D3.A
N$9
  Top 0.254: C13.1 16.63,13.52 16.26,13.89 16.26,15.16 15.75,15.67 U4.3
N$10
  Top 0.254: C16.2 32.57,27.95 B1.4
N$11
  Top 0.254: C17.1 31.15,27.77 B1.3
N$12
  Top 0.254: C13.2 16.14,11.72 15.75,12.12 15.75,14.91 15.49,15.17 U4.2
N$13
  Top 0.254: R6.1 D2.A
N$14
  Top 0.254: R4.1 17.13,18.6 17.02,18.72 11.94,18.72 U4.8
N$15
  Top 0.254: U4.7 12.45,18.21 15.75,18.21 16.26,17.7 16.26,16.04 R7.1
N$16
  Top 0.254: C14.2 12.56,12.25 12.45,12.37 U4.15
N$17
  Top 0.254: R8.1 16.76,21.51 16.26,21.01 U5.10
N$18
  Top 0.254: R9.1 17.02,19.74 16.26,20.5 13.91,20.5 U5.9
N$19
  Top 0.254: C22.2 11.68,24.31 11.94,24.05 11.94,22.97 U5.16
N$29  (via drill 0.41)
  Top 0.254: 25.65,3.48 U3.16
  Top 0.406: U3.16 25.4,3.99 27.18,3.99 v27.69,3.48
  Bottom 0.254: 27.55,3.6 v27.69,3.48
  Bottom 0.406: K1.2 27.55,3.6
N$30  (via drill 0.41)
  Top 0.406: U3.15 v24.13,5.26
  Bottom 0.406: v24.13,5.26 22.61,6.78 11.94,6.78 10.16,5 3.56,5 1.78,6.78 1.78,31.56 K2.2
N$31  (via drill 0.41)
  Top 0.254: U3.14 22.86,4.5 21.34,6.02 20.32,6.02 18.54,4.75 14.99,4.75 v14.99,2.46
  Bottom 0.406: v14.99,2.46 2.4,2.46 K3.2
N$32  (via drill 0.41)
  Top 0.254: U3.13 21.59,3.99
  Top 0.406: 21.59,3.99 v20.57,5 | v40.39,4.5 v40.39,2.46
  Bottom 0.406: v20.57,5 20.57,2.46 21.08,1.96 39.88,1.96 v40.39,2.46 | K4.2 41.77,33.31 41.15,32.69 41.15,25.83 43.18,23.8 43.18,5.77 42.42,5 40.89,5 v40.39,4.5
PB4
  Top 0.254: U3.3 22.86,9.58 23.37,10.08 27.43,10.08 27.94,10.59 U1.40
PB5
  Top 0.254: U3.2 24.13,9.32 24.38,9.58 28.19,9.58 28.45,9.83 U1.41
PB6
  Top 0.254: R5.2 28.96,13.19 U1.42
PB7
  Top 0.254: U1.43 29.46,13.18 29.46,9.92 R6.2
PE3  (via drill 0.41)
  Top 0.254: v32.77,11.1 32.77,13.88 U1.49 | U3.4 21.59,7.04 22.1,6.53 25.91,6.53 26.67,5.77 v26.67,5
  Bottom 0.254: v32.77,11.1 33.53,10.34 34.8,10.34 35.56,9.58 35.56,5.77 34.29,4.5 27.94,4.5 27.43,5 v26.67,5
PE4  (via drill 0.41)
  Top 0.254: U1.50 33.43,14.45 33.81,14.07 33.81,9.55 v33.83,9.53 | U3.1 26.5,8.03 27.43,7.1 27.43,6.43 v27.48,6.38
  Bottom 0.254: v33.83,9.53 33.83,6.33 33.02,5.51 27.69,5.51 27.69,6.17 v27.48,6.38
RESET  (via drill 0.41)
  Top 0.254: C15.2 11.18,28.54 S1.1 12.41,29.52 R1.1 13.88,27.86 v12.19,27.86 | v26.42,24.31 26.42,22.23 U1.12
  Bottom 0.254: J1.5 41.66,23.55 40.89,24.31 v26.42,24.31 14.99,24.31 12.19,27.1 v12.19,27.86
RFANT
  Top 0.254: 30.84,29.39 30.95,29.39 B1.1
  Top 0.61: 29.21,29.39 25.15,29.39 24.89,29.13 C9.2 | A1.FEED 29.21,29.39 | 30.84,29.39 29.21,29.39
RFN
  Top 0.254: C17.2 32.85,24.4 32.51,24.05 28.7,24.05 27.94,23.29 U1.9
RFP
  Top 0.254: U1.8 28.44,22.78 28.96,23.29 35.31,23.29 37.08,25.07 C16.1
RX0  (via drill 0.41)
  Top 0.254: U1.46 30.94,11.31 v30.73,11.1
  Bottom 0.254: JP9.TXO 5.84,19.74 5.84,14.91 8.38,12.37 12.19,12.37 16.89,7.34 30.73,7.34 v30.73,11.1
RX1  (via drill 0.41)
  Top 0.254: v38.61,8.81 39.88,8.81 40.64,9.58 JP1.2 | U1.27 23.67,16.43 22.35,16.43 21.08,15.16 v21.08,14.66
  Bottom 0.254: v38.61,8.81 37.34,8.81 33.53,12.62 29.46,12.62 29.46,8.41 24.43,8.41 21.08,11.76 v21.08,14.66
SCK  (via drill 0.41)
  Top 0.254: J1.3 41.66,20.75 40.89,21.51 v36.32,21.51 | v24.64,11.1 25.4,11.86 25.91,11.86 26.42,12.37 26.42,13.18 U1.37
  Bottom 0.254: v36.32,21.51 36.07,21.51 35.05,20.5 30.48,20.5 24.64,14.66 v24.64,11.1
SCL  (via drill 0.41)
  Top 0.254: U5.12 15.25,22.01 v15.49,21.77 | v20.57,17.45 U1.25 | U4.4 14.98,16.17 v15.24,16.43
  Bottom 0.254: v20.57,17.45 17.78,17.45 15.49,19.74 v15.49,21.77 15.24,22.02 11.68,22.02 11.18,21.51 11.18,17.45 12.19,16.43 v15.24,16.43
SDA  (via drill 0.41)
  Top 0.254: v15.24,17.45 12.95,17.45 U4.6 | U1.26 21.86,16.95 21.34,16.43 v20.07,16.43 | U5.11 12.7,21.51 v12.45,21.26
  Bottom 0.254: v12.45,21.26 12.45,17.96 14.73,17.96 v15.24,17.45 16.76,17.45 17.78,16.43 v20.07,16.43
TX0  (via drill 0.41)
  Top 0.254: U1.47 31.44,11.91 31.75,11.61 v31.75,10.08
  Bottom 0.254: v31.75,10.08 31.75,11.61 31.5,11.86 29.97,11.86 29.97,7.87 17.12,7.87 12.45,12.88 8.64,12.88 6.35,15.16 6.35,21.77 JP9.RXI
TX1  (via drill 0.41)
  Top 0.254: v22.1,13.13 22.1,15.16 22.89,15.95 U1.28
  Bottom 0.254: JP1.1 40.13,7.04 39.62,7.54 39.62,9.32 38.1,10.85 36.83,10.85 34.04,13.64 28.88,13.64 28.88,8.87 24.84,8.87 22.1,11.61 v22.1,13.13
VBAT
  Top 0.254: 16.51,2.21 U3.9 | 13.4,1.51 13.46,1.45 | 11.5,1.51 11.43,1.45 | K1.1 42.81,2.35 | 41.4,2.46 41.52,2.35 41.4,2.23
  Top 0.406: 3.3,4.5 JP3.2 1.78,9.58 1.78,29.39 3.56,31.17 3.56,32.69 3.05,33.2 2.4,33.2 K2.1 | 3.3,4.5 C23.1 6.52,2.04 7.11,1.45 11.43,1.45 13.46,1.45 16.51,1.45 | K3.1 2.29,4.24 2.54,4.5 3.3,4.5 | U3.9 16.51,1.45 | U2.3 13.4,1.51 | U2.1 11.5,1.51 | K1.1 41.52,2.35 | 41.4,2.46 41.4,3.99 43.18,5.77 43.18,31.3 K4.1 | 16.51,1.45 41.4,1.45 41.4,2.23

### Text on the board
tPlace: UCSDQuadCop Rev 0 | DTR | RX0 | 3.3V | TX0 | 3.3V | GND | GND | GND | GND | 3.3V | GND | RX1 | VBAT | TX1
tDocu: 1.76 inch / 44.70 mm | 1.41 inch / 35.81 mm | >Info / Board Name: UCSDQuadCop / Part Number: 0 / Number of Layers: 2 / Board Material Type: FR-4 / Solder Mask Color: Red / Silkscreen Color: White / Finish Plating: HASAL / Revision Number: 0